# Altium schematic sheet FPGA.SchDoc
size A; SheetNumber: 3; SheetTotal: 4
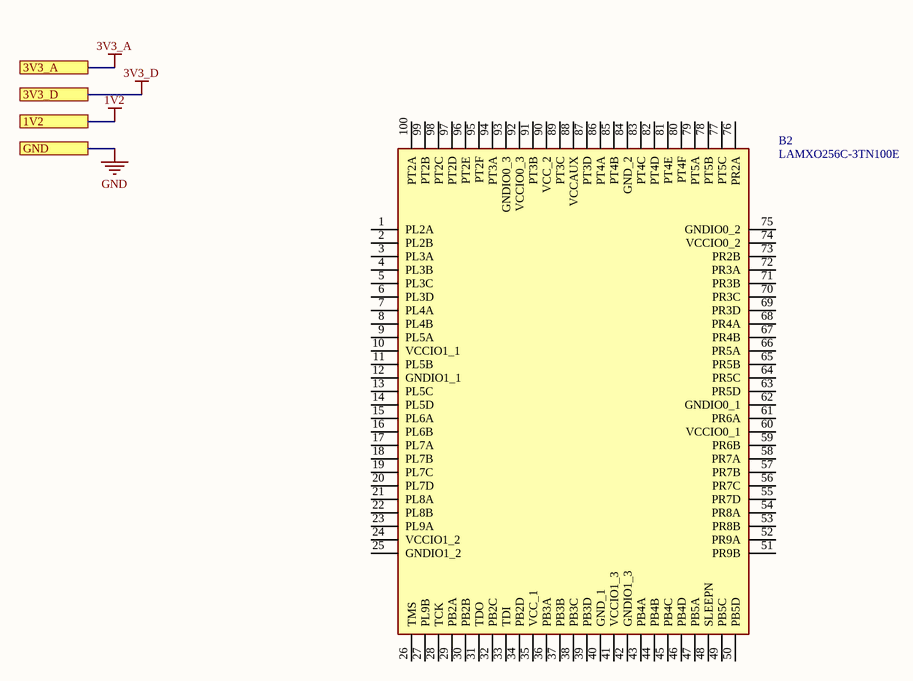
[diagram p0: FPGA.SchDoc]

## Parts
B2  LAMXO256C-3TN100E  [QFP50P1600X1600X160-100N]

## Ports
1V2, 3V3_A, 3V3_D, GND

## Nets
1V2: port 1V2
3V3_A: port 3V3_A
3V3_D: port 3V3_D
GND: port GND

Not connected (* = marked no-connect by the designer): B2 1(PL2A) 2(PL2B) 3(PL3A) 4(PL3B) 5(PL3C) 6(PL3D) 7(PL4A) 8(PL4B) 9(PL5A) 10(VCCIO1_1) 11(PL5B) 12(GNDIO1_1) 13(PL5C) 14(PL5D) 15(PL6A) 16(PL6B) 17(PL7A) 18(PL7B) 19(PL7C) 20(PL7D) 21(PL8A) 22(PL8B) 23(PL9A) 24(VCCIO1_2) 25(GNDIO1_2) 26(TMS) 27(PL9B) 28(TCK) 29(PB2A) 30(PB2B) 31(TDO) 32(PB2C) 33(TDI) 34(PB2D) 35(VCC_1) 36(PB3A) 37(PB3B) 38(PB3C) 39(PB3D) 40(GND_1) 41(VCCIO1_3) 42(GNDIO1_3) 43(PB4A) 44(PB4B) 45(PB4C) 46(PB4D) 47(PB5A) 48(SLEEPN) 49(PB5C) 50(PB5D) 51(PR9B) 52(PR9A) 53(PR8B) 54(PR8A) 55(PR7D) 56(PR7C) 57(PR7B) 58(PR7A) 59(PR6B) 60(VCCIO0_1) 61(PR6A) 62(GNDIO0_1) 63(PR5D) 64(PR5C) 65(PR5B) 66(PR5A) 67(PR4B) 68(PR4A) 69(PR3D) 70(PR3C) 71(PR3B) 72(PR3A) 73(PR2B) 74(VCCIO0_2) 75(GNDIO0_2) 76(PR2A) 77(PT5C) 78(PT5B) 79(PT5A) 80(PT4F) 81(PT4E) 82(PT4D) 83(PT4C) 84(GND_2) 85(PT4B) 86(PT4A) 87(PT3D) 88(VCCAUX) 89(PT3C) 90(VCC_2) 91(PT3B) 92(VCCIO0_3) 93(GNDIO0_3) 94(PT3A) 95(PT2F) 96(PT2E) 97(PT2D) 98(PT2C) 99(PT2B) 100(PT2A)

## Library data of the parts
B2 = LAMXO256C-3TN100E: FPGA - Field Programmable Gate Array Auto Grade (AEC-Q100 ) MachXO256C; Manufacturer_Name: Lattice Semiconductor; Geometry.Height: 1.6mm; Mouser Part Number: 842-LAMXO256C3TN100E; Mouser Price/Stock: https://www.mouser.co.uk/ProductDetail/Lattice/LAMXO256C-3TN100E?qs=p%2Fkho2dxmzgvijKb3pAMgw%3D%3D; Manufacturer_Part_Number: LAMXO256C-3TN100E; Datasheet Link: https://www.latticesemi.com/~/media/LatticeSemi/Documents/Solutions/Packaging%20Solutions/LA_MachXO%20Automotive%20Family%20Data%20Sheet.pdf